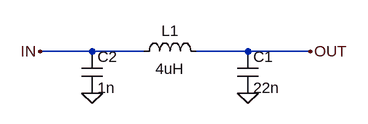
[diagram p0: schematic subcircuit_edit.asc]
subcircuit_edit.asc, the LTspice schematic file:
Version 4
SHEET 1 880 680
WIRE -48 144 -128 144
WIRE 32 144 -48 144
WIRE 192 144 112 144
WIRE 288 144 192 144
FLAG -48 208 0
FLAG 192 208 0
FLAG -128 144 IN
FLAG 288 144 OUT
SYMBOL cap 176 144 R0
SYMATTR InstName C1
SYMATTR Value 22n
SYMBOL cap -64 144 R0
SYMATTR InstName C2
SYMATTR Value 1n
SYMBOL ind 16 160 R270
WINDOW 0 32 56 VTop 2
WINDOW 3 5 56 VBottom 2
SYMATTR InstName L1
SYMATTR Value 4uH

The netlist it stands for:
* subcircuit_edit.asc
C1 OUT 0 22n
C2 IN 0 1n
L1 IN OUT 4uH
.backanno
.end